# Altium project GPS-speed.PrjPcb
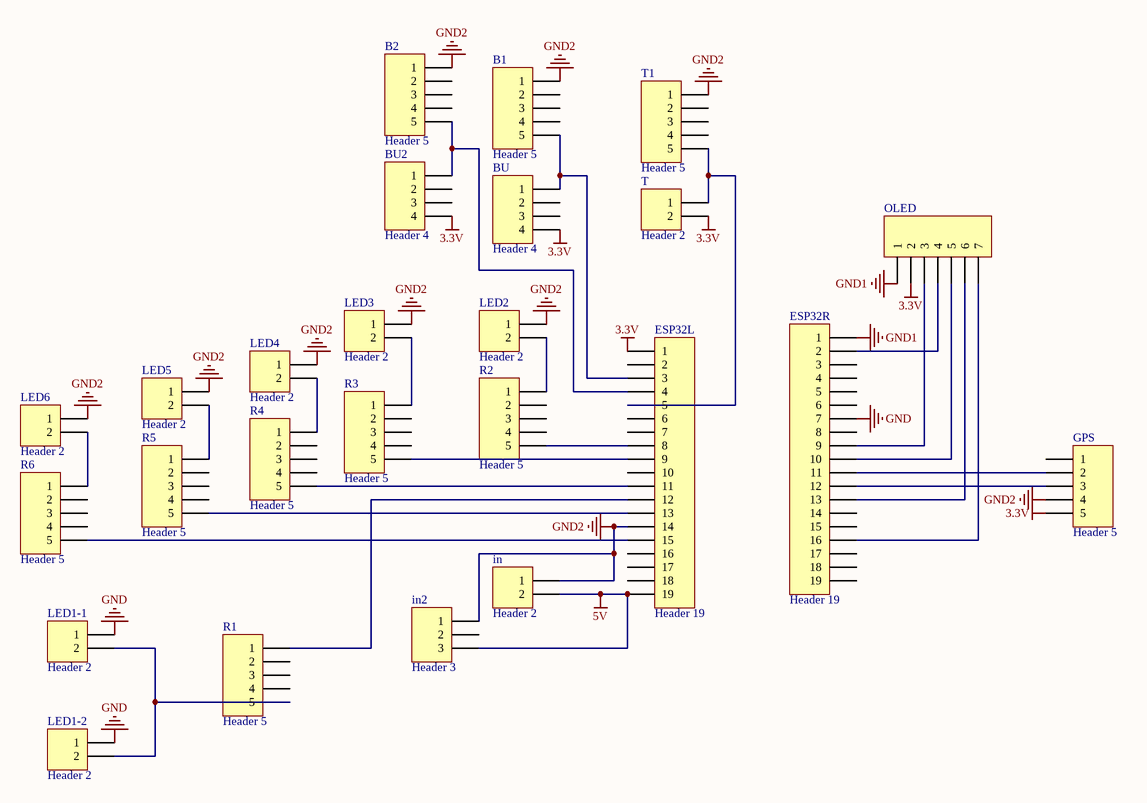
[diagram p0: GPS-speed.SchDoc]
1 sheet, 25 parts. Net scope: global (net labels, ports and power ports of the same name join across sheets).
Board files: GPS-speed.PcbDoc, GPS-speed1.PcbDoc

## Sheet GPS-speed.SchDoc
size A4

### Parts
B1  Header 5  [HDR1X5]
B2  Header 5  [HDR1X5]
BU  Header 4  [HDR1X4]
BU2  Header 4  [HDR1X4]
ESP32L  Header 19  [HDR1X19]
ESP32R  Header 19  [HDR1X19]
GPS  Header 5  [HDR1X5]
in  Header 2  [HDR1X2]
in2  Header 3  [HDR1X3]
LED1-1  Header 2  [HDR1X2]
LED1-2  Header 2  [HDR1X2]
LED2  Header 2  [HDR1X2]
LED3  Header 2  [HDR1X2]
LED4  Header 2  [HDR1X2]
LED5  Header 2  [HDR1X2]
LED6  Header 2  [HDR1X2]
OLED  Header 7  [HDR1X7]  (value not drawn)
R1  Header 5  [HDR1X5]
R2  Header 5  [HDR1X5]
R3  Header 5  [HDR1X5]
R4  Header 5  [HDR1X5]
R5  Header 5  [HDR1X5]
R6  Header 5  [HDR1X5]
T  Header 2  [HDR1X2]
T1  Header 5  [HDR1X5]

### Nets
3.3V: BU.4 BU2.4 ESP32L.1 GPS.5 OLED.2 T.2
5V: ESP32L.19 in.2 in2.3
GND: ESP32R.7 LED1-1.1 LED1-2.1
GND1: ESP32R.1 OLED.1
GND2: B1.1 B2.1 ESP32L.14 GPS.4 in.1 in2.1 LED2.1 LED3.1 LED4.1 LED5.1 LED6.1 T1.1
NetB1_5: B1.5 BU.1 ESP32L.3
NetB2_5: B2.5 BU2.1 ESP32L.4
NetESP32L_5: ESP32L.5 T.1 T1.5
NetESP32L_8: ESP32L.8 R2.5
NetESP32L_9: ESP32L.9 R3.5
NetESP32L_11: ESP32L.11 R4.5
NetESP32L_12: ESP32L.12 R1.1
NetESP32L_13: ESP32L.13 R5.5
NetESP32L_15: ESP32L.15 R6.5
NetESP32R_2: ESP32R.2 OLED.4
NetESP32R_9: ESP32R.9 OLED.3
NetESP32R_10: ESP32R.10 OLED.5
NetESP32R_11: ESP32R.11 GPS.2
NetESP32R_12: ESP32R.12 GPS.3
NetESP32R_13: ESP32R.13 OLED.6
NetESP32R_16: ESP32R.16 OLED.7
NetLED1-1_2: LED1-1.2 LED1-2.2 R1.5
NetLED2_2: LED2.2 R2.1
NetLED3_2: LED3.2 R3.1
NetLED4_2: LED4.2 R4.1
NetLED5_2: LED5.2 R5.1
NetLED6_2: LED6.2 R6.1

Not connected (* = marked no-connect by the designer): B1 2 3 4; B2 2 3 4; BU 2 3; BU2 2 3; ESP32L 2 6 7 10 16 17 18; ESP32R 3 4 5 6 8 14 15 17 18 19; GPS 1; in2 2; R1 2 3 4; R2 2 3 4; R3 2 3 4; R4 2 3 4; R5 2 3 4; R6 2 3 4; T1 2 3 4

### Library data of the parts
B1 B2 GPS R1-R6 T1 = Header 5: Header, 5-Pin; LatestRevisionDate: 17-Jul-2002; LatestRevisionNote: Re-released for DXP Platform.; Publisher: Altium Limited
BU BU2 = Header 4: Header, 4-Pin; LatestRevisionDate: 17-Jul-2002; LatestRevisionNote: Re-released for DXP Platform.; Publisher: Altium Limited
ESP32L ESP32R = Header 19: Header, 19-Pin; LatestRevisionDate: 17-Jul-2002; LatestRevisionNote: Re-released for DXP Platform.; Publisher: Altium Limited
in LED1-1 LED1-2 LED2-LED6 T = Header 2: Header, 2-Pin; LatestRevisionDate: 17-Jul-2002; LatestRevisionNote: Re-released for DXP Platform.; Publisher: Altium Limited
in2 = Header 3: Header, 3-Pin; LatestRevisionDate: 17-Jul-2002; LatestRevisionNote: Re-released for DXP Platform.; Publisher: Altium Limited
OLED = Header 7: Header, 7-Pin; LatestRevisionDate: 17-Jul-2002; LatestRevisionNote: Re-released for DXP Platform.; Publisher: Altium Limited